# Altium schematic sheet pioneer_2-bluepill_eletronic_wrapper-bluetooth.SchDoc
size A; SheetNumber: 3; SheetTotal: 3
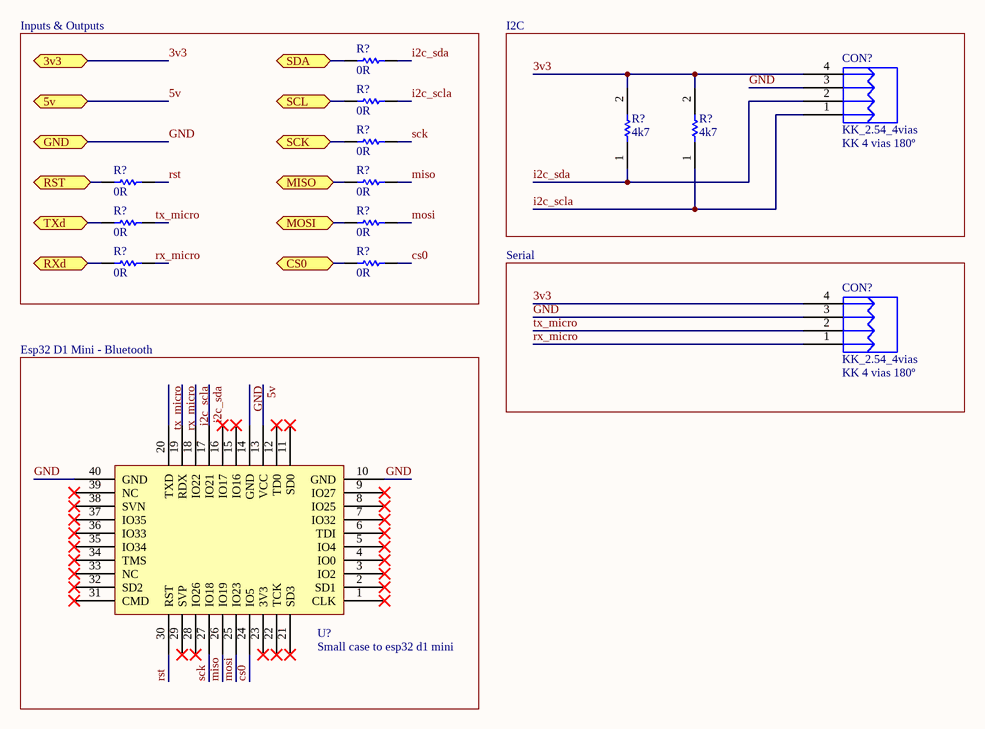
[diagram p0: pioneer_2-bluepill_eletronic_wrapper-bluetooth.SchDoc]

## Parts
(Parts that share a designator on the sheet are numbered #1, #2 ... from top to bottom, then left to right.)
CON?#1  KK_2.54_4vias  Valor: KK 4 vias 180º  [KK_4vias_180°]
CON?#2  KK_2.54_4vias  Valor: KK 4 vias 180º  [KK_4vias_180°]
R?#1  0R  [RESISTOR 0603]
R?#2  0R  [RESISTOR 0603]
R?#3  0R  [RESISTOR 0603]
R?#4  4k7  [RESC3216X60N]
R?#5  4k7  [RESC3216X60N]
R?#6  0R  [RESISTOR 0603]
R?#7  0R  [RESISTOR 0603]
R?#8  0R  [RESISTOR 0603]
R?#9  0R  [RESISTOR 0603]
R?#10  0R  [RESISTOR 0603]
R?#11  0R  [RESISTOR 0603]
U?  Small case to esp32 d1 mini  [ESP32 D1 MINI]

## Blocks framed on the sheet
Inputs & Outputs: R?#1-R?#3 R?#6-R?#11
I2C: CON?#1 R?#4 R?#5
Serial: CON?#2
Esp32 D1 Mini - Bluetooth: U?

## Ports
3v3 (bidir, see pioneer_2-bluepill_eletronic_wrapper[3C], pioneer_2-bluepill_eletronic_wrapper-supply[1A]), 5v (bidir, see pioneer_2-bluepill_eletronic_wrapper[3C], pioneer_2-bluepill_eletronic_wrapper-supply[1A]), CS0 (bidir, see pioneer_2-bluepill_eletronic_wrapper[3C]), GND (bidir, see pioneer_2-bluepill_eletronic_wrapper[3C], pioneer_2-bluepill_eletronic_wrapper-supply[1A]), MISO (bidir, see pioneer_2-bluepill_eletronic_wrapper[3C]), MOSI (bidir, see pioneer_2-bluepill_eletronic_wrapper[3C]), RST (bidir, see pioneer_2-bluepill_eletronic_wrapper[3C]), RXd (bidir, see pioneer_2-bluepill_eletronic_wrapper[3C]), SCK (bidir, see pioneer_2-bluepill_eletronic_wrapper[3C]), SCL (bidir, see pioneer_2-bluepill_eletronic_wrapper[3C]), SDA (bidir, see pioneer_2-bluepill_eletronic_wrapper[3C]), TXd (bidir, see pioneer_2-bluepill_eletronic_wrapper[3C])

## Nets
3v3: CON?#1.4 CON?#2.4 R?#4.2 R?#5.2 ; port 3v3
5v: U?.13(VCC) ; port 5v
cs0: R?#11.2 U?.24(IO5)
CS0: R?#11.1 ; port CS0  [a separate net that carries the same name]
GND: CON?#1.3 CON?#2.3 U?.10(GND) U?.14(GND) U?.40(GND) ; port GND
i2c_scla: CON?#1.1 R?#2.2 R?#5.1 U?.18(IO22)
i2c_sda: CON?#1.2 R?#1.2 R?#4.1 U?.17(IO21)
miso: R?#7.2 U?.26(IO19)
MISO: R?#7.1 ; port MISO  [a separate net that carries the same name]
mosi: R?#9.2 U?.25(IO23)
MOSI: R?#9.1 ; port MOSI  [a separate net that carries the same name]
rst: R?#6.2 U?.30(RST)
RST: R?#6.1 ; port RST  [a separate net that carries the same name]
rx_micro: CON?#2.1 R?#10.2 U?.19(RDX)
RXd: R?#10.1 ; port RXd
sck: R?#3.2 U?.27(IO18)
SCK: R?#3.1 ; port SCK  [a separate net that carries the same name]
SCL: R?#2.1 ; port SCL
SDA: R?#1.1 ; port SDA
tx_micro: CON?#2.2 R?#8.2 U?.20(TXD)
TXd: R?#8.1 ; port TXd

Not connected (* = marked no-connect by the designer): U? 1(CLK)* 2(SD1)* 3(IO2)* 4(IO0)* 5(IO4)* 6(TDI)* 7(IO32)* 8(IO25)* 9(IO27)* 11(SD0)* 12(TD0)* 15(IO16)* 16(IO17)* 21(SD3)* 22(TCK)* 23(3V3)* 28(IO26)* 29(SVP)* 31(CMD)* 32(SD2)* 33(NC)* 34(TMS)* 35(IO34)* 36(IO33)* 37(IO35)* 38(SVN)* 39(NC)*

## Library data of the parts
CON?#1 CON?#2 = KK_2.54_4vias: Conector KK 2.54mm 4 vias; Descrição: Conector KK 3 vias com passo 2.54mm; Encapsulamento: PTH - 180º; Modelo: 3 vias - 180º; Marca: *; Observação: *
R?#1-R?#3 R?#6-R?#11 = RES 0603 5%: 0603; Manufacturer: PANASONIC ELECTRONIC COMPONENTS; Manufacturer Part Number: ERJ-3GEY0R00V; Product Range: AEC-Q200 ERJ3; Resistance: 0; Power Rating: 100; Voltage Rating: 75; Resistor Case Style: 0603 [1608 Metric]; Resistance (Ohms): 0.0; Tolerance: Jumper; Power (Watts): 0.1W, 1/10W; Brand: Panasonic; Qualification: AEC-Q200; RoHS: YES; Resistance Tolerance: -; Packaging: Cut Tape; MSL: -; ComponentLink1URL: http://www.farnell.com/cad/1697908.zip; ComponentLink1Description: http://www.farnell.com/cad/1697908.zip; ComponentLink2URL: http://www.farnell.com/datasheets/1678796.pdf; ComponentLink2Description: http://www.farnell.com/datasheets/1678796.pdf; Category: Resistors; Composition: Thick Film; Features: Automotive AEC-Q200; Temperature Coefficient: -; Operating Temperature: -55°C ~ 155°C; Package / Case: 0603 (1608 Metric); Supplier Device Package: 0603; Size / Dimension: 0.063" L x 0.031" W (1.60mm x 0.80mm); Height: 0.022" (0.55mm); Number of Terminations: 2; ComponentLink3URL: http://industrial.panasonic.com/www-cgi/jvcr13pz.cgi?E+PZ+3+AOA0001+ERJ3GEY0R00V+7+WW; ComponentLink3Description: http://industrial.panasonic.com/www-cgi/jvcr13pz.cgi?E+PZ+3+AOA0001+ERJ3GEY0R00V+7+WW; Supplier 1: Mouser; Stock 1: 1987085; Pricing 1: 1=0.160, 10=0.019, 100=0.013, 500=0.010, 1000=0.005, 5000=0.003 (AUD); Length: 1.6 mm; Operating Temperature Range: - 55 C to + 155 C; Product: Thick Film Resistors Zero-Ohm; Series: ERJ; Termination Style: SMD/SMT; Type: Thick Film Resistors SMD; Width: 0.8 mm; Case Code - in: 0603; Case Code - mm: 1608; RoHS - Mouser: E; Minimum Order Quantity: 1; Reeling: True; ComponentLink4URL: http://www.mouser.com/ds/2/315/AOA0000C84-947596.pdf; ComponentLink4Description: http://www.mouser.com/ds/2/315/AOA0000C84-947596.pdf; Supplier Part Number 1: 667-ERJ-3GEY0R00V
R?#4 = RES 1206: RES 1206 5% SMD; Manufacturer_Name: Vishay; Manufacturer_Part_Number: CRCW12064K70FKEA; Datasheet Link: http://docs-emea.rs-online.com/webdocs/13ec/0900766b813ecc08.pdf; Height: 0.6mm; Mouser Part Number: 71-CRCW1206-4.7K-E3; Mouser Price/Stock: https://www.mouser.co.uk/ProductDetail/Vishay-Dale/CRCW12064K70FKEA?qs=1vm4qhDHCvlKJmatsKzyFQ%3D%3D; Arrow Part Number: CRCW12064K70FKEA; Arrow Price/Stock: https://www.arrow.com/en/products/crcw12064k70fkea/vishay
R?#5 = RES 1206: RES 1206 5%; Manufacturer_Name: Vishay; Manufacturer_Part_Number: CRCW12064K70FKEA; Datasheet Link: http://docs-emea.rs-online.com/webdocs/13ec/0900766b813ecc08.pdf; Height: 0.6mm; Mouser Part Number: 71-CRCW1206-4.7K-E3; Mouser Price/Stock: https://www.mouser.co.uk/ProductDetail/Vishay-Dale/CRCW12064K70FKEA?qs=1vm4qhDHCvlKJmatsKzyFQ%3D%3D; Arrow Part Number: CRCW12064K70FKEA; Arrow Price/Stock: https://www.arrow.com/en/products/crcw12064k70fkea/vishay
U? = ESP32 D1 Mini